# EAGLE schematic SmartMatrixSD_V3 (EAGLE 7.2.0)
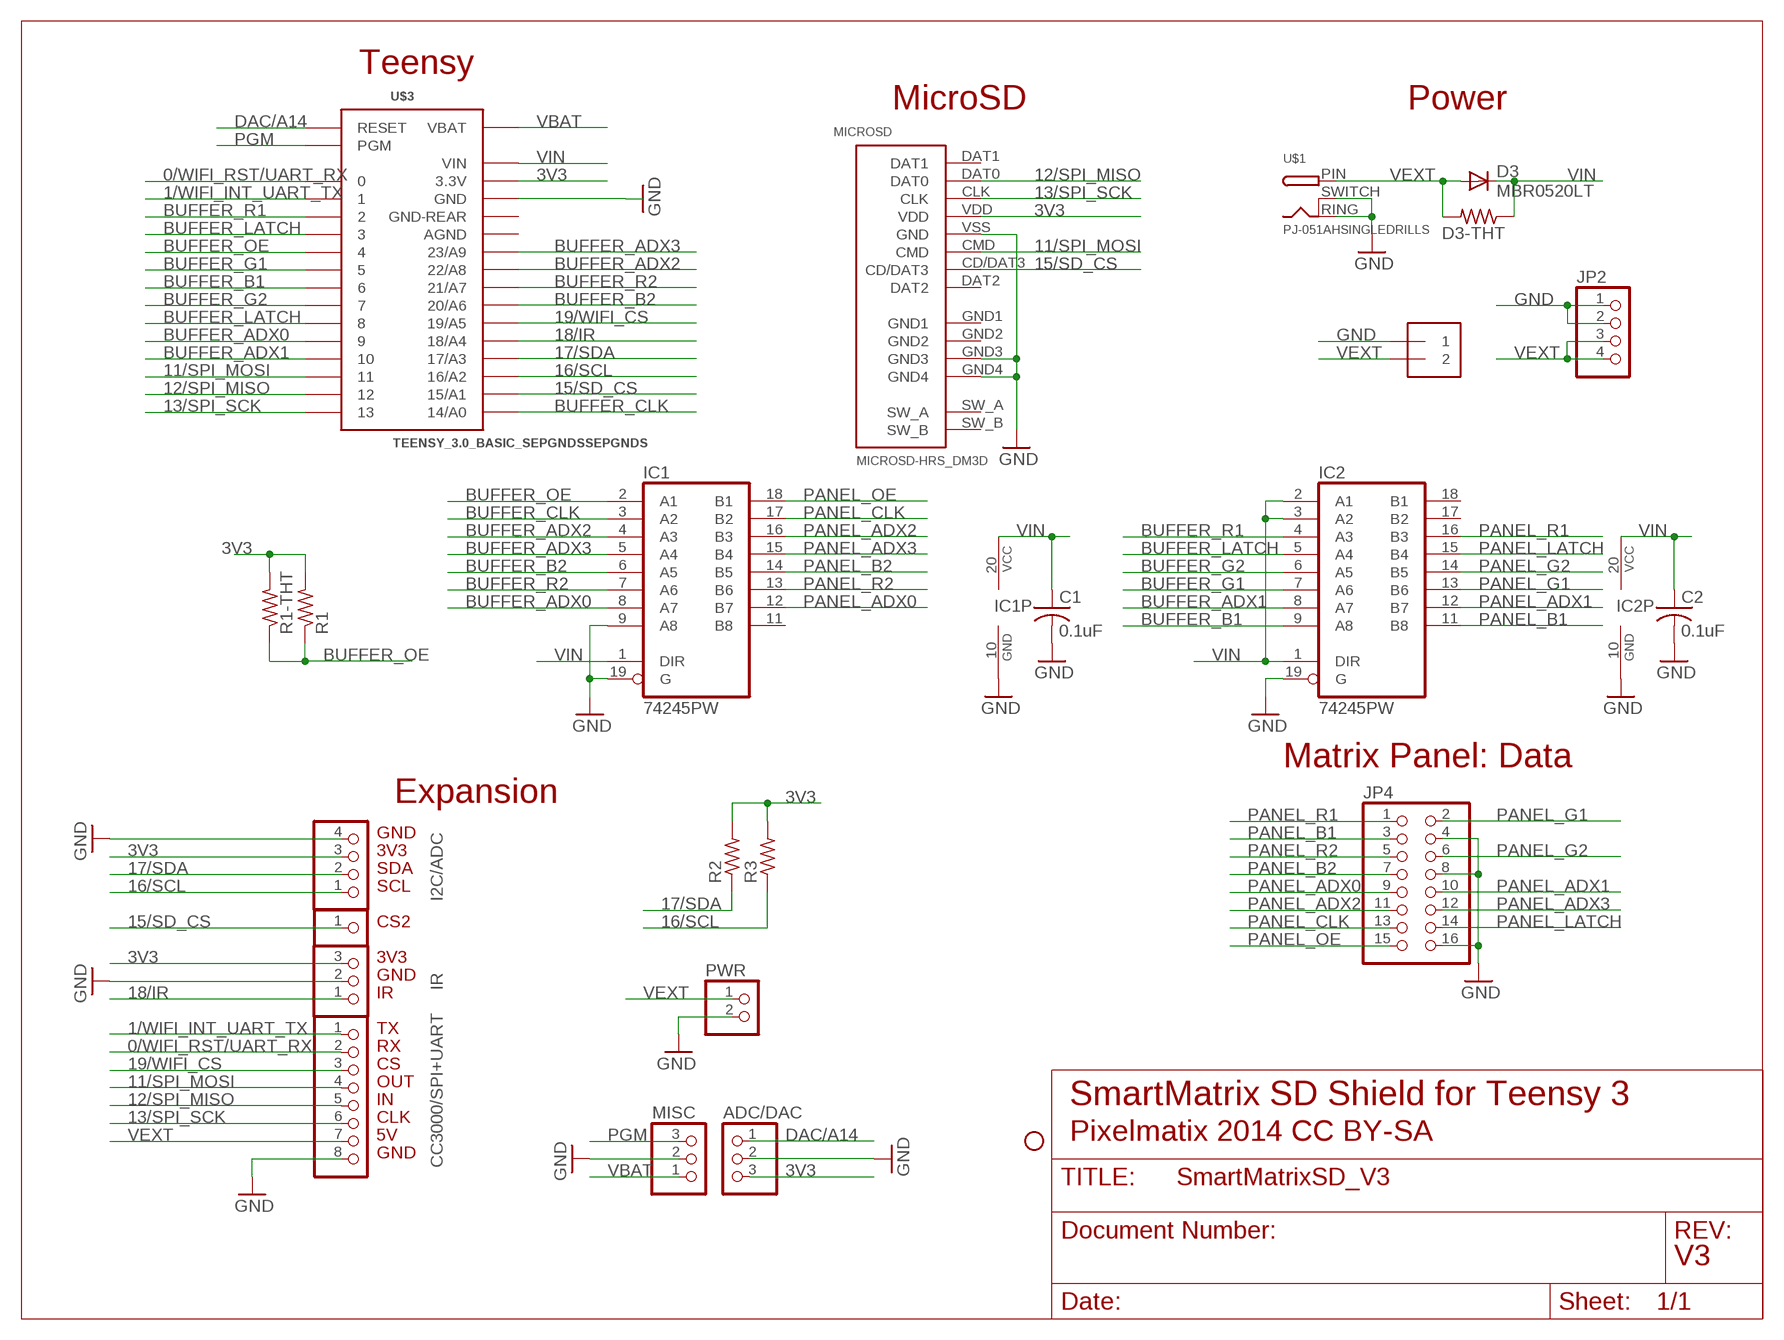
[diagram p0: schematic, sheet 1]

## Parts
ADC/DAC  PINHD-1X03_2.54-S  [1X03-S]
C1  0.1uF  C-USC0603  [C0603]
C2  0.1uF  C-USC0603  [C0603]
CC3000/SPI+UART  PINHD-1X08_2.54-S  [1X08-S]
CS2  PINHD-1X01_2.54-S  [1X01-S]
D3  MBR0520LT  [SOD123]
D3-THT  R-US_0207/2V  [0207/2V]
I2C/ADC  PINHD-1X04_2.54-S  [1X04-S]
IC1  74245PW  [TSSOP-20]
IC2  74245PW  [TSSOP-20]
IR  PINHD-1X03_2.54-S  [1X03-S]
J4  1X2-5.0  [1X2-5.0MM]
JP2  PINHD-1X04_1.56  [1X04-1.56"]
JP4  PINHD-2X08_2.54  [2X08]
JP5  STAND-OFFSTAND-OFF-3MM  [STAND-OFF-3MM]
MICROSD  MICROSD-HRS_DM3D  [DM3D]
MISC  PINHD-1X03_2.54-S  [1X03-S]
PWR  PINHD-1X02_2.54-S  [1X02-S]
R1  R-US_R0603  [R0603]
R1-THT  R-US_0207/2V  [0207/2V]
R2  R-US_0207/7  [0207/7]
R3  R-US_0207/7  [0207/7]
U$1  PJ-051AHSINGLEDRILLS  [PJ-051AH-SINGLEDRILLS]
U$3  TEENSY_3.0_BASIC_SEPGNDSSEPGNDS  [TEENSY_3.0_BASIC]

## Nets
0/WIFI_RST/UART_RX: CC3000/SPI+UART.2 U$3.0
1/WIFI_INT_UART_TX: CC3000/SPI+UART.1 U$3.1
3V3 [power]: ADC/DAC.3 I2C/ADC.3 IR.3 MICROSD.VDD R1-THT.2 R1.2 R2.2 R3.2 U$3.3.3V U$3.3.3V1(3.3V)
11/SPI_MOSI: CC3000/SPI+UART.4 MICROSD.CMD U$3.11
12/SPI_MISO: CC3000/SPI+UART.5 MICROSD.DAT0 U$3.12
13/SPI_SCK: CC3000/SPI+UART.6 MICROSD.CLK U$3.13
15/SD_CS: CS2.1 MICROSD.CD/DAT3 U$3.15/A1
16/SCL: I2C/ADC.1 R3.1 U$3.16/A2
17/SDA: I2C/ADC.2 R2.1 U$3.17/A3
18/IR: IR.1 U$3.18/A4
19/WIFI_CS: CC3000/SPI+UART.3 U$3.19/A5
BUFFER_ADX0: IC1.8(A7) U$3.9
BUFFER_ADX1: IC2.8(A7) U$3.10
BUFFER_ADX2: IC1.4(A3) U$3.22/A8
BUFFER_ADX3: IC1.5(A4) U$3.23/A9
BUFFER_B1: IC2.9(A8) U$3.6
BUFFER_B2: IC1.6(A5) U$3.20/A6
BUFFER_CLK: IC1.3(A2) U$3.14/A0
BUFFER_G1: IC2.7(A6) U$3.5
BUFFER_G2: IC2.6(A5) U$3.7
BUFFER_LATCH: IC2.5(A4) U$3.3 U$3.8
BUFFER_OE: IC1.2(A1) R1-THT.1 R1.1 U$3.4
BUFFER_R1: IC2.4(A3) U$3.2
BUFFER_R2: IC1.7(A6) U$3.21/A7
DAC/A14: ADC/DAC.1 U$3.RESET
GND [power]: ADC/DAC.2 C1.2 C2.2 CC3000/SPI+UART.8 I2C/ADC.4 IC1.9(A8) IC1.10(GND) IC1.19(G) IC2.10(GND) IC2.19(G) IR.2 J4.1 JP2.1 JP2.2 JP4.4 JP4.8 JP4.16 MICROSD.GND3 MICROSD.GND4 MICROSD.VSS(GND) MISC.2 PWR.2 U$1.RING(GND) U$1.SWITCH(GNDBREAK) U$3.GND
PANEL_ADX0: IC1.12(B7) JP4.9
PANEL_ADX1: IC2.12(B7) JP4.10
PANEL_ADX2: IC1.16(B3) JP4.11
PANEL_ADX3: IC1.15(B4) JP4.12
PANEL_B1: IC2.11(B8) JP4.3
PANEL_B2: IC1.14(B5) JP4.7
PANEL_CLK: IC1.17(B2) JP4.13
PANEL_G1: IC2.13(B6) JP4.2
PANEL_G2: IC2.14(B5) JP4.6
PANEL_LATCH: IC2.15(B4) JP4.14
PANEL_OE: IC1.18(B1) JP4.15
PANEL_R1: IC2.16(B3) JP4.1
PANEL_R2: IC1.13(B6) JP4.5
PGM: MISC.3 U$3.PGM
VBAT: MISC.1 U$3.VBAT
VEXT [power]: CC3000/SPI+UART.7 D3-THT.2 D3.A J4.2 JP2.3 JP2.4 PWR.1 U$1.PIN(PWR)
VIN [power]: C1.1 C2.1 D3-THT.1 D3.C IC1.1(DIR) IC1.20(VCC) IC2.1(DIR) IC2.2(A1) IC2.3(A2) IC2.20(VCC) U$3.VIN
Unconnected: IC1.11(B8) IC2.17(B2) IC2.18(B1) MICROSD.DAT1 MICROSD.DAT2 MICROSD.GND1 MICROSD.GND2 MICROSD.SW_A MICROSD.SW_B

## Notes on the sheet
- Teensy
- MicroSD | Power
- Matrix Panel: Data
- Expansion
- GND
- 3V3
- SDA
- SCL
- CS2
- 3V3
- GND
- IR
- TX
- RX
- CS
- OUT
- IN | SmartMatrix SD Shield for Teensy 3
- CLK
- 5V | Pixelmatix 2014 CC BY-SA
- GND
- V3

## Power pins joined to a net without a drawn wire
AGND: U$3.AGND
GND-REAR: U$3.GND1(GND-REAR)

## Library data of the parts
ADC/DAC IR MISC = pinhead-2:PINHD-1X03: PIN HEADER
C1 C2 = scanlime:C-US: CAPACITOR, American symbol; PARTNO: CAP CER 0.1UF 10V 10% X7R 0805
CC3000/SPI+UART = pinhead-2:PINHD-1X08: PIN HEADER
CS2 = pinhead-2:PINHD-1X01: PIN HEADER
D3 = diode:MBR0520LT: SCHOTTKY BARRIER RECTIFIER Source: http://onsemi.com .. MBR0520LT1-D.pdf
D3-THT R1 R1-THT R2 R3 = rcl:R-US_: RESISTOR, American symbol
I2C/ADC = pinhead-2:PINHD-1X04: PIN HEADER
IC1 IC2 = eclibrary:74*245: Octal BUS TRANSCEIVER, 3-state
J4 = eclibrary:1X2: 3.5mm Terminal block - matches dimensions of 4Uconnector part# 19974 from http://www.ladyada.net/library/pcb/eaglelibrary.html 5.0mm Terminal block - matches dimensions of 4Uconnector part# 20182
JP2 = eclibrary:PINHD-1X04: PIN HEADER
JP4 = pinhead-2:PINHD-2X08: PIN HEADER
JP5 = eclibrary:STAND-OFF: Stand Off STAND-OFF-2.5MM is Using dimensions for 4.5mm diameter Hex Standoff (2.598mm keepout radius = outer radius of standoff) STAND-OFF-3MM is Using dimensions for a 6mm diameter Hex screw (3mm keepout radius), assuming a smaller 4.5mm diameter hex standoff is used Other parts are from sparkfun sample
MICROSD = hrs_DM3D-SF:MICROSD-HRS_DM3D
PWR = pinhead-2:PINHD-1X02: PIN HEADER
U$1 = eclibrary:PJ-051AH
U$3 = eclibrary:TEENSY_3.0_BASIC_SEPGNDS

## Net classes
0 default: width 0.254 mm
1 power: width 0.406 mm